# EAGLE design blank_rev_3dip (EAGLE 6.3)
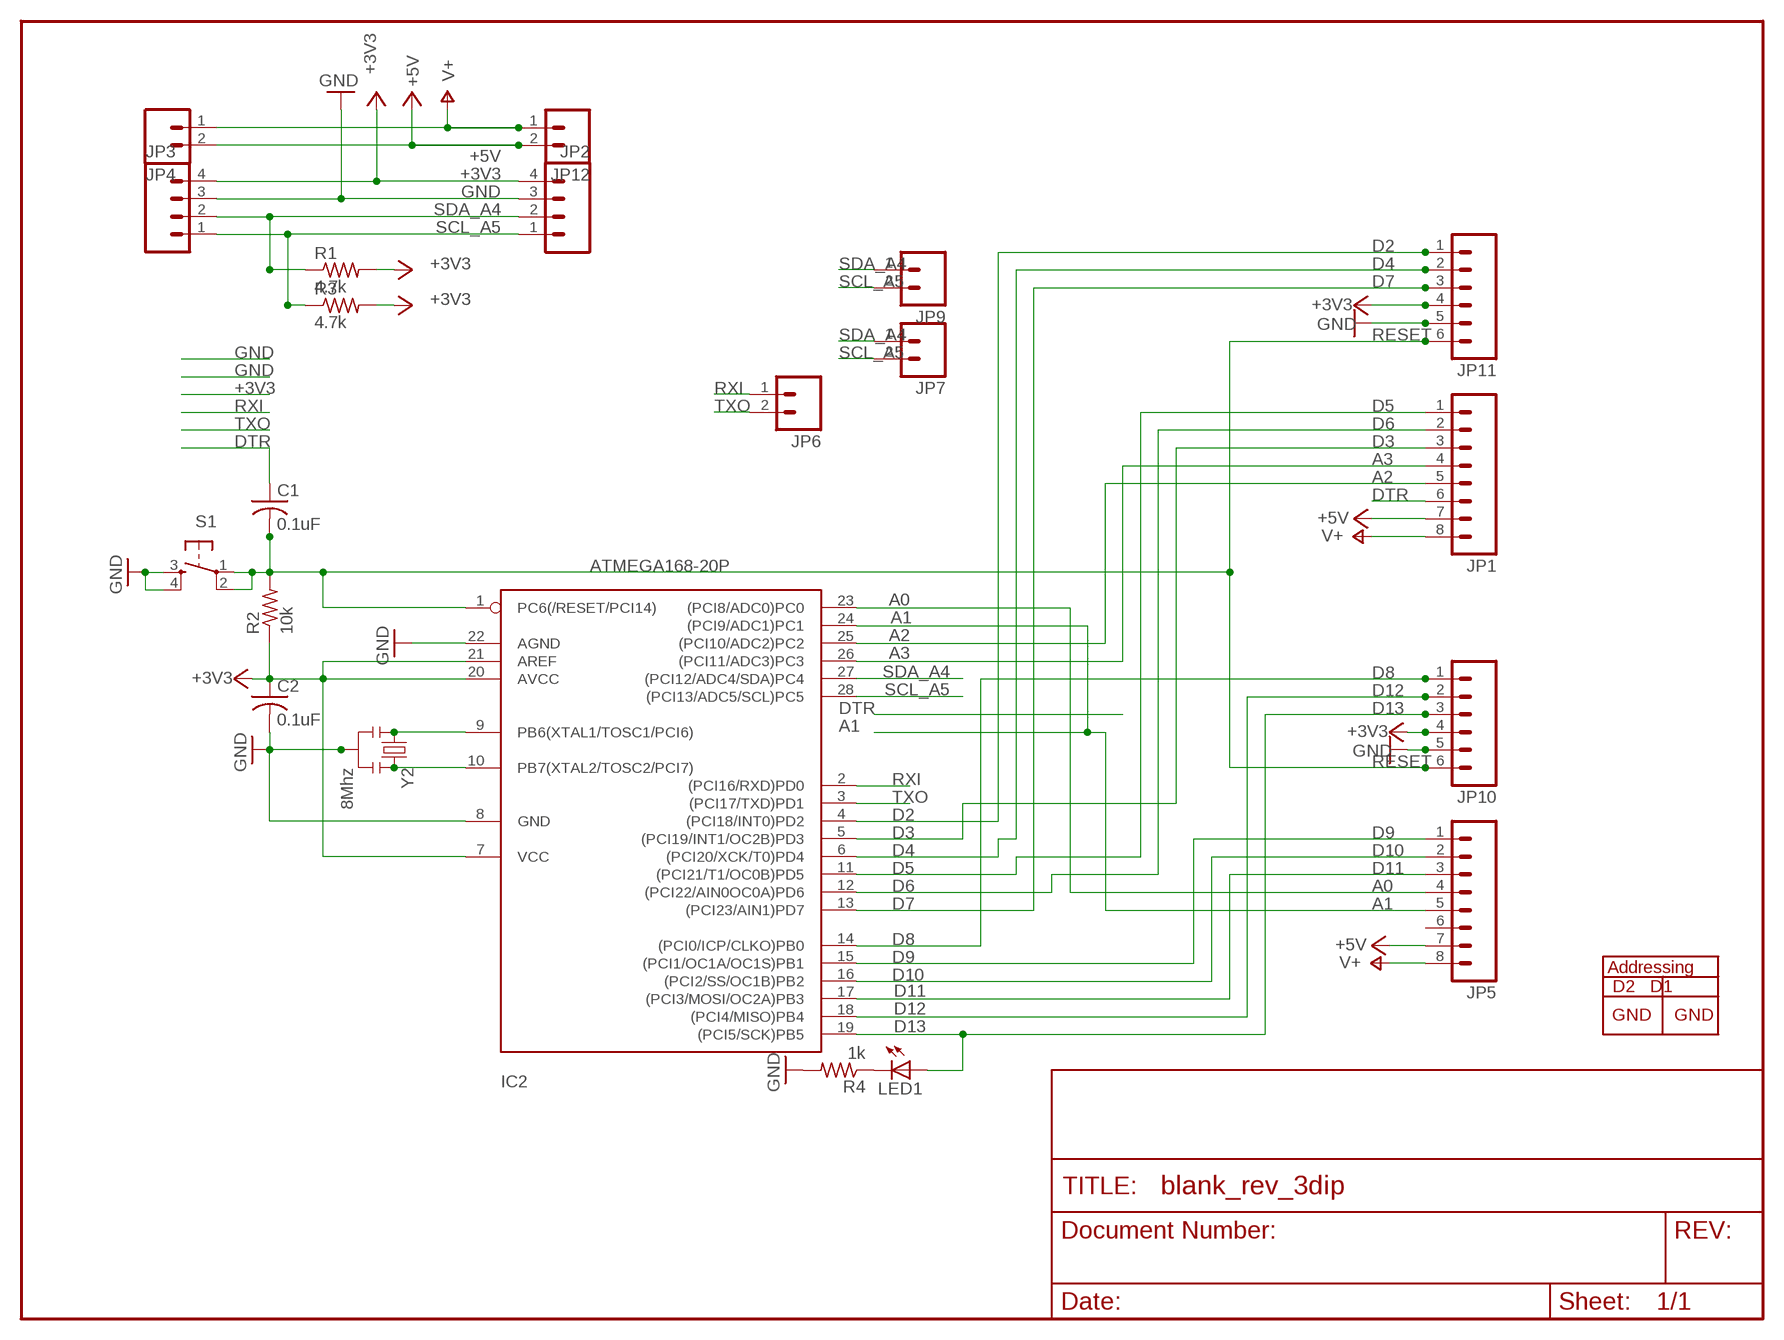
[diagram p0: schematic, sheet 1]

## Parts
C1  0.1uF  C-US025-024X044  [C025-024X044]
C2  0.1uF  C-US025-024X044  [C025-024X044]
IC2  ATMEGA168-20P  [DIL28-3]
JP1  M081X08  [1X08]
JP2  M04PTH  [1X04]
JP3  M04PTH  [1X04]
JP4  M02PTH  [1X02]
JP5  M081X08  [1X08]
JP6  M02PTH  [1X02]
JP7  M02PTH  [1X02]
JP9  M02PTH  [1X02]
JP10  M06SIP  [1X06]
JP11  M06SIP  [1X06]
JP12  M02PTH  [1X02]
LED1  LED3MM  [LED3MM]
R1  4.7k  R-US_0204/7  [0204/7]
R2  10k  R-US_0204/7  [0204/7]
R3  4.7k  R-US_0204/7  [0204/7]
R4  1k  R-US_0204/7  [0204/7]
S1  TAC_SWITCHPTH  [TACTILE-PTH]
Y2  8Mhz  RESONATORPTH  [RESONATOR-PTH]

## Nets
+3V3: C2.1 IC2.7(VCC) IC2.20(AVCC) IC2.21(AREF) JP2.4 JP3.4 JP10.4 JP11.4 R1.2 R2.1 R3.2
+5V: JP1.7 JP4.2 JP5.7 JP12.2
A0: IC2.23((PCI8/ADC0)PC0) JP5.4
A1: IC2.24((PCI9/ADC1)PC1) JP5.5
A2: IC2.25((PCI10/ADC2)PC2) JP1.5
A3: IC2.26((PCI11/ADC3)PC3) JP1.4
D2: IC2.4((PCI18/INT0)PD2) JP11.1
D3: IC2.5((PCI19/INT1/OC2B)PD3) JP1.3
D4: IC2.6((PCI20/XCK/T0)PD4) JP11.2
D5: IC2.11((PCI21/T1/OC0B)PD5) JP1.1
D6: IC2.12((PCI22/AIN0OC0A)PD6) JP1.2
D7: IC2.13((PCI23/AIN1)PD7) JP11.3
D8: IC2.14((PCI0/ICP/CLKO)PB0) JP10.1
D9: IC2.15((PCI1/OC1A/OC1S)PB1) JP5.1
D10: IC2.16((PCI2/SS/OC1B)PB2) JP5.2
D11: IC2.17((PCI3/MOSI/OC2A)PB3) JP5.3
D12: IC2.18((PCI4/MISO)PB4) JP10.2
D13: IC2.19((PCI5/SCK)PB5) JP10.3 LED1.A
DTR: C1.1 JP1.6
GND: C2.2 IC2.8(GND) IC2.22(AGND) JP2.3 JP3.3 JP10.5 JP11.5 R4.2 S1.3 S1.4 Y2.2
N$1: IC2.10(PB7(XTAL2/TOSC2/PCI7)) Y2.3
N$3: IC2.9(PB6(XTAL1/TOSC1/PCI6)) Y2.1
N$4: LED1.K(C) R4.1
RESET: C1.2 IC2.1(PC6(/RESET/PCI14)) JP10.6 JP11.6 R2.2 S1.1 S1.2
RXI: IC2.2((PCI16/RXD)PD0) JP6.1
SCL_A5: IC2.28((PCI13/ADC5/SCL)PC5) JP2.1 JP3.1 JP7.2 JP9.2 R3.1
SDA_A4: IC2.27((PCI12/ADC4/SDA)PC4) JP2.2 JP3.2 JP7.1 JP9.1 R1.1
TXO: IC2.3((PCI17/TXD)PD1) JP6.2
V+: JP1.8 JP4.1 JP5.8 JP12.1
Unconnected: JP5.6

## Library data of the parts
C1 C2 = adafruit:C-US: CAPACITOR, American symbol
IC2 = adafruit:ATMEGA168*P: MICROCONTROLLER 16 kBytes FLASH 1 kBytes SRAM 512 Bytes EEPROM USART 8-channel 10 bit ADC
JP1 JP5 = SparkFun_mod:M08: Header 8 Standard 8-pin 0.1" header. Use with straight break away headers (SKU : PRT-00116), right angle break away headers (PRT-00553), swiss pins (PRT-00743), machine pins (PRT-00117), and female headers (PRT-00115).
JP2 JP3 = SparkFun_mod:M04: Header 4 Standard 4-pin 0.1" header. Use with straight break away headers (SKU : PRT-00116), right angle break away headers (PRT-00553), swiss pins (PRT-00743), machine pins (PRT-00117), and female headers (PRT-00115). Molex polarized connector foot print use with SKU : PRT-08231 with associated crimp pins and housings. 1MM SMD Version SKU: PRT-10208
JP4 JP6 JP7 JP9 JP12 = SparkFun_mod:M02: Header 2 Standard 2-pin 0.1" header. Use with straight break away headers (SKU : PRT-00116), right angle break away headers (PRT-00553), swiss pins (PRT-00743), machine pins (PRT-00117), and female headers (PRT-00115). Molex polarized connector foot print use with SKU : PRT-08233 with associated crimp pins and housings.
JP10 JP11 = SparkFun_mod:M06: Header 6 Standard 6-pin 0.1" header. Use with straight break away headers (SKU : PRT-00116), right angle break away headers (PRT-00553), swiss pins (PRT-00743), machine pins (PRT-00117), and female headers (PRT-00115). Molex polarized connector foot print use with SKU : PRT-08094 with associated crimp pins and housings. NOTES ON THE VARIANTS LOCK and LOCK_LONGPADS... This footprint was designed to help hold the alignment of a through-hole component (i.e. 6-pin header) while soldering it into place. You may notice that each hole has been shifted either up or down by 0.005 of an inch from it's more standard position (which is a perfectly straight line). This slight alteration caused the pins (the squares in the middle) to touch the edges of the holes. Because they are alternating, it causes a "brace" to hold the component in place. 0.005 has proven to be the perfect amount of "off-center" position when using our standard breakaway headers. Although looks a little odd when you look at the bare footprint, once you have a header in there, the alteration is very hard to notice. Also, if you push a header all the way into place, it is covered up entirely on the bottom side. This idea of altering the position of holes to aid alignment will be further integrated into the Sparkfun Library for other footprints. It can help hold any component with 3 or more connection pins.
LED1 = adafruit:LED: LED OSRAM: - CHIPLED LG R971, LG N971, LY N971, LG Q971, LY Q971, LO R971, LY R971 LH N974, LH R974 LS Q976, LO Q976, LY Q976 LO Q996 - Hyper CHIPLED LW Q18S LB Q993, LB Q99A, LB R99A - SideLED LS A670, LO A670, LY A670, LG A670, LP A670 LB A673, LV A673, LT A673, LW A673 LH A674 LY A675 LS A676, LA A676, LO A676, LY A676, LW A676 LS A679, LY A679, LG A679 - Hyper Micro SIDELED® LS Y876, LA Y876, LO Y876, LY Y876 LT Y87S - SmartLED LW L88C, LW L88S LB L89C, LB L89S, LG L890 LS L89K, LO L89K, LY L89K LS L896, LA L896, LO L896, LY L896 - TOPLED LS T670, LO T670, LY T670, LG T670, LP T670 LSG T670, LSP T670, LSY T670, LOP T670, LYG T670 LG T671, LOG T671, LSG T671 LB T673, LV T673, LT T673, LW T673 LH T674 LS T676, LA T676, LO T676, LY T676, LB T676, LH T676, LSB T676, LW T676 LB T67C, LV T67C, LT T67C, LS T67K, LO T67K, LY T67K, LW E67C LS E67B, LA E67B, LO E67B, LY E67B, LB E67C, LV E67C, LT E67C LW T67C LS T679, LY T679, LG T679 LS T770, LO T770, LY T770, LG T770, LP T770 LB T773, LV T773, LT T773, LW T773 LH T774 LS E675, LA E675, LY E675, LS T675 LS T776, LA T776, LO T776, LY T776, LB T776 LHGB T686 LT T68C, LB T68C - Hyper Mini TOPLED® LB M676 - Mini TOPLED Santana® LG M470 LS M47K, LO M47K, LY M47K Source: http://www.osram.convergy.de/
R1-R4 = adafruit:R-US_: RESISTOR, American symbol
S1 = SparkFun:TAC_SWITCH: Momentary Switch Button commonly used for reset or general input. Spark Fun Electronics SKU : COM-00097
Y2 = SparkFun_mod:RESONATOR: Resonator Small SMD resonator. This is the itty bitty 10/20MHz resonators with built in caps. CSTCE10M0G55 and CSTCE20M0V53. Footprint has been reviewed closely but hasn't been tested yet.

## Net classes
0 default: width 0.203 mm
1 vcc: width 0.254 mm

## Board
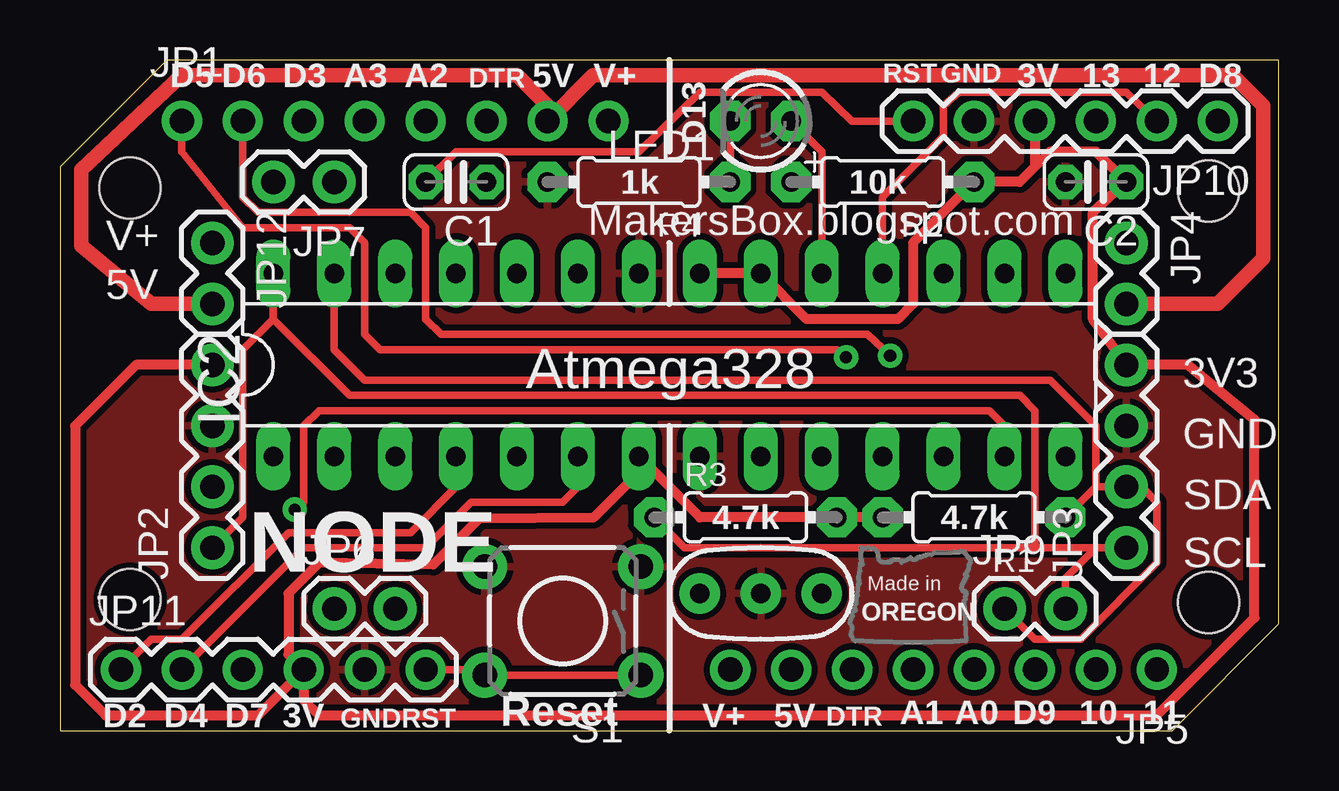
[diagram p1: board, top side]
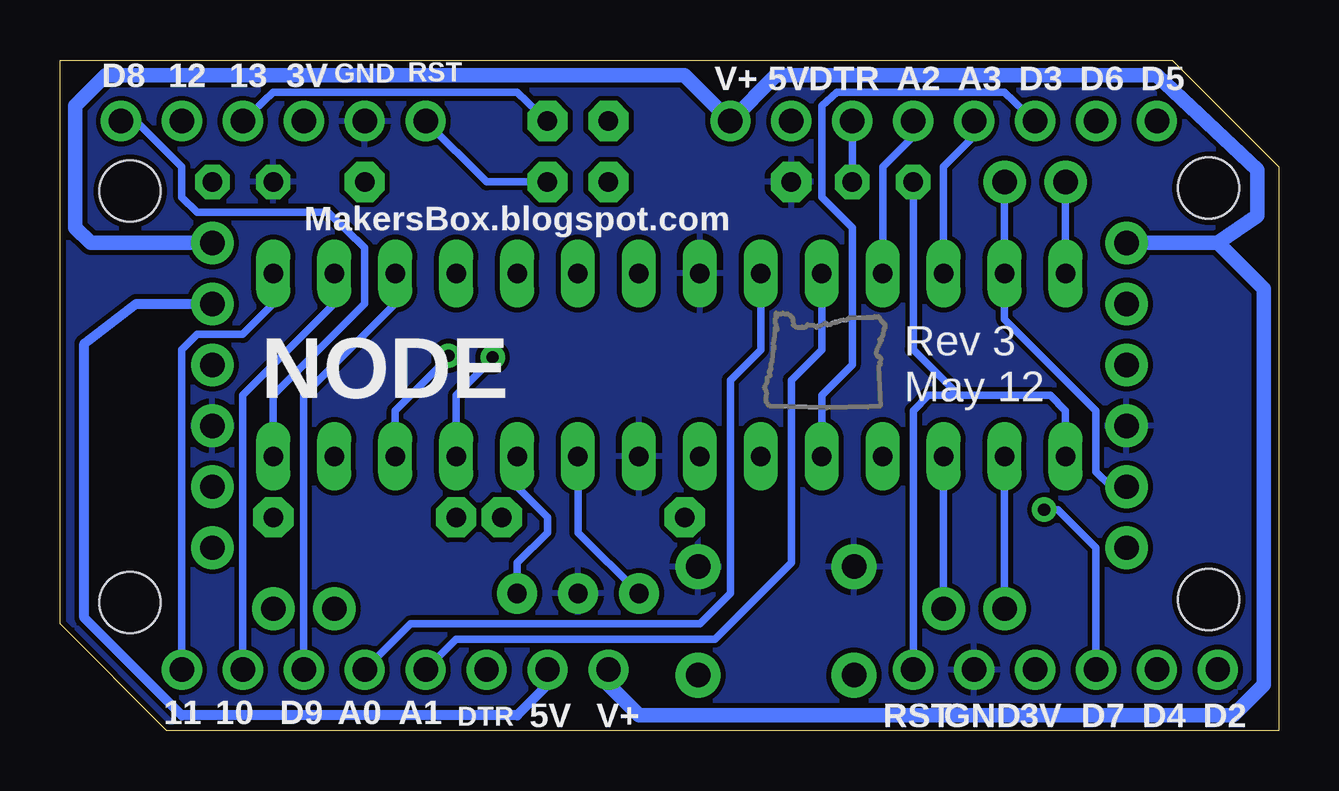
[diagram p2: board, bottom side, seen from below]

Size 50.8 x 27.94 mm. Coordinates in mm from the lower left corner, seen from the top.
Outline: 50.8,4.45 46.36,0 25.4,0 24.77,0 20.96,0 0,0 0,22.86 0,23.5 4.45,27.94 25.4,27.94
Outline: 50.8,4.45 50.8,4.45
Outline: 50.8,4.45 50.8,22.86 50.8,27.94
Outline: 50.8,27.94 27.94,27.94
Outline: 27.94,27.94 27.94,27.94
Outline: 27.94,27.94 25.4,27.94
Copper layers (1*16): Top 0.035mm / dielectric 1.5mm / Bottom 0.035mm
Design rules "SparkFun": minimum track width 8mil, minimum drill 20mil, track to track 8mil, track to pad 8mil, pad to pad 8mil, via to via 8mil, smd to smd 8mil, copper to edge 10mil, drill to drill 8mil, minimum pad ring 12mil, minimum via ring 10mil, stop-mask expansion 4mil, vias tented up to drill 25mil, thermal gap 10mil
Holes 2.54 mm at 47.88,22.48 2.92,5.46 2.92,22.61 47.88,5.33

### Footprints (pad centres in the part's own frame; a part is rotated, then mirrored left to right if it is on the bottom)
C025-024X044 = drill 0.813 pad 1.422 octagon: 1 -1.27,0; 2 1.27,0
DIL28-3 = drill 0.813 long: 1 -16.51,-3.81; 2 -13.97,-3.81; 3 -11.43,-3.81; 4 -8.89,-3.81; 5 -6.35,-3.81; 6 -3.81,-3.81; 7 -1.27,-3.81; 8 1.27,-3.81; 9 3.81,-3.81; 10 6.35,-3.81; 11 8.89,-3.81; 12 11.43,-3.81; 13 13.97,-3.81; 14 16.51,-3.81; 15 16.51,3.81; 16 13.97,3.81; 17 11.43,3.81; 18 8.89,3.81; 19 6.35,3.81; 20 3.81,3.81; 21 1.27,3.81; 22 -1.27,3.81; 23 -3.81,3.81; 24 -6.35,3.81; 25 -8.89,3.81; 26 -11.43,3.81; 27 -13.97,3.81; 28 -16.51,3.81
1X08 = drill 1.016 pad 1.676: 1 0,0; 2 2.54,0; 3 5.08,0; 4 7.62,0; 5 10.16,0; 6 12.7,0; 7 15.24,0; 8 17.78,0
1X04 = drill 1.016 pad 1.778: 1 0,0; 2 2.54,0; 3 5.08,0; 4 7.62,0
1X02 = drill 1.016 pad 1.778: 1 0,0; 2 2.54,0
1X06 = drill 1.016 pad 1.676: 1 0,0; 2 2.54,0; 3 5.08,0; 4 7.62,0; 5 10.16,0; 6 12.7,0
LED3MM = drill 0.813 pad 1.676 octagon: A -1.27,0; K 1.27,0
0204/7 = drill 0.813 pad 1.676 octagon: 1 -3.81,0; 2 3.81,0
TACTILE-PTH = drill 1.016 pad 1.88: 1 -3.251,2.261; 2 3.251,2.261; 3 -3.251,-2.261; 4 3.251,-2.261
RESONATOR-PTH = drill 0.8 pad 1.676: 1 -2.54,0; 2 0,0; 3 2.54,0

### Placement (x,y rotation side)
C1  16.51,22.86 180 top
C2  43.18,22.86 180 top
IC2  25.4,15.24 0 top
JP1  5.08,25.4 0 top
JP2  6.35,7.62 90 top
JP3  44.45,7.62 90 top
JP4  44.45,20.32 270 top
JP5  45.72,2.54 180 top
JP6  11.43,5.08 0 top
JP7  11.43,22.86 180 top
JP9  39.37,5.08 0 top
JP10  48.26,25.4 180 top
JP11  2.54,2.54 0 top
JP12  6.35,20.32 270 top
LED1  29.21,25.4 180 top
R1  38.1,8.89 180 top
R2  34.29,22.86 180 top
R3  28.57,8.89 0 top
R4  24.13,22.86 180 top
S1  20.95,4.57 180 top
U$1  [OREGON_24_52]  20.95,17.4 0 top
U$2  [OREGON_24_51]  33.4,7.62 0 top
Y2  29.21,5.71 0 top

### Tracks (layer width: path | path; a pad name or v marks a point on that pad's centre or on a via)
+3V3
  Top 0.406: JP2.4 3.17,15.24 0.64,12.7 0.64,1.91 1.91,0.64 8.26,0.64 JP11.4 | JP11.4 10.16,1.27 10.79,0.64 45.72,0.64 49.78,4.7 49.78,12.95 46.99,15.24 JP3.4 43.05,17.14 43.05,21.59 C2.1 43.18,24.13 41.27,24.13 40.64,23.5 | JP10.4 40.64,23.5 | 40.64,23.5 40.01,22.86 R2.1 35.56,20.32 35.56,17.78 34.92,17.14 31.11,17.14 IC2.20 IC2.21 | 22.23,8.89 22.23,8.88 | 22.23,8.88 17.46,8.83 15.56,6.92 10.79,6.98 9.53,5.71 9.53,3.17 JP11.4 | R3.2 R1.2 26.67,8.89 IC2.7 24.13,10.78 22.23,8.88
+5V
  Top 0.61: JP4.2 48.26,17.78 50.16,19.68 50.16,26.04 48.9,27.3 22.23,27.3 JP1.7 20.32,26.04 19.05,27.3 5.08,27.3 0.89,23.37 0.89,20.19 3.81,17.78 JP12.2
  Bottom 0.406: JP5.7 30.48,1.91 31.75,0.64 45.72,0.64 49.78,4.7 49.78,16.13 47.62,17.78 JP4.2
A0
  Bottom 0.305: JP5.4 36.2,4.45 24.13,4.45 22.86,5.71 22.86,14.61 21.59,15.88 IC2.23
A1
  Bottom 0.305: IC2.24 19.05,15.88 20.32,14.61 20.32,6.98 23.5,3.81 34.29,3.81 JP5.5
A2
  Bottom 0.305: JP1.5 15.24,24.77 16.51,23.5 IC2.25
A3
  Bottom 0.305: JP1.4 12.7,24.77 13.97,23.5 IC2.26
D2
  Top 0.305: IC2.4 16.51,10.16 14.61,8.26 9.53,8.26 5.08,3.81 3.81,3.81 JP11.1
D3
  Bottom 0.305: JP1.3 11.43,26.61 18.41,26.61 19.05,26.04 19.05,22.22 17.78,20.95 17.78,15.24 19.05,13.97 IC2.5
D4
  Top 0.305: IC2.6 21.59,10.16 20.95,9.53 17.14,9.53 15.24,7.62 10.16,7.62 JP11.2
D5  (via drill 0.51)
  Top 0.305: JP1.1 5.08,24.13 7.62,20.95 12.06,20.95 12.7,20.32 12.7,16.51 13.34,15.88 32.38,15.88 v32.77,15.56
  Bottom 0.305: v32.77,15.56 32.77,15.49 34.29,13.97 IC2.11
D6  (via drill 0.51)
  Top 0.305: v34.61,15.62 33.66,16.51 15.88,16.51 15.24,17.14 15.24,20.95 14.61,21.59 8.26,21.59 7.62,22.22 JP1.2
  Bottom 0.305: IC2.12 36.83,13.33 34.92,15.24 v34.61,15.62
D7  (via drill 0.51)
  Top 0.305: IC2.13 39.37,12.7 38.73,13.33 10.79,13.33 10.16,12.7 10.16,9.53 v9.78,9.21
  Bottom 0.305: v9.78,9.21 9.21,9.21 7.62,7.62 JP11.3
D8
  Bottom 0.305: IC2.14 41.91,13.97 38.1,17.78 38.1,20.13 39.62,21.59 45.09,21.59 45.72,22.22 45.72,23.5 47.62,25.4 JP10.1
D9
  Bottom 0.305: IC2.15 41.91,17.78 43.18,16.51 45.09,16.51 45.72,15.88 JP5.1
D10
  Bottom 0.305: IC2.16 39.37,17.78 43.18,13.97 JP5.2
D11
  Bottom 0.305: IC2.17 36.83,17.78 40.64,13.97 JP5.3
D12
  Top 0.305: JP10.2 44.45,26.61 37.47,26.61 36.83,26.04 36.83,24.77 34.29,22.22 IC2.18
D13
  Top 0.305: IC2.19 31.75,24.13 LED1.A
  Bottom 0.305: JP10.3 41.91,26.61 31.75,26.61 LED1.A
DTR
  Bottom 0.305: C1.1 JP1.6
GND
  pour Top (isolate 0.254): -1.91,29.21 52.07,29.21 52.07,-1.27 -2.54,-0.64
  pour Bottom: -3.17,28.57 52.07,28.57 52.7,-0.64 -2.54,0
N$1
  Bottom 0.305: IC2.10 31.75,10.16 30.48,8.89 30.48,8.26 31.75,6.98 Y2.3
N$3
  Bottom 0.305: Y2.1 29.21,8.26 IC2.9
N$4
  Top 0.305: R4.1 LED1.K
RESET
  Top 0.305: JP11.6 17.6,2.54 S1.2 S1.1 | JP10.6 33.02,25.4 31.75,26.61 26.67,26.61 24.13,24.13 16.51,24.13 C1.2
  Bottom 0.305: C1.2 15.24,15.88 13.34,13.97 | 13.34,13.97 9.53,13.97 8.89,13.33 IC2.1 | 13.34,13.97 14.61,13.97 15.24,13.33 JP11.6 | R2.2 33.02,22.86 JP10.6
RXI
  Bottom 0.305: IC2.2 JP6.1
SCL_A5
  Top 0.305: 8.89,17.14 12.06,13.97 40.01,13.97 40.64,13.33 40.64,7.62 | 8.89,17.14 IC2.28 | JP2.1 7.62,8.89 7.62,15.88 8.89,17.14 | 43.18,7.62 JP3.1 | JP9.2 41.91,6.35 43.18,7.62 | 43.18,7.62 40.64,7.62 | R3.1 26.04,7.62 40.64,7.62
  Bottom 0.305: JP7.2 IC2.28
SDA_A4
  Top 0.305: IC2.27 11.43,15.88 12.7,14.61 41.27,14.61 43.18,12.7 43.18,10.16 | 43.18,10.16 JP3.2 45.09,10.16 45.72,9.53 45.72,6.98 42.55,3.81 40.64,3.81 JP9.1 | 43.18,10.16 R1.1
  Bottom 0.305: JP2.2 6.99,10.16 7.62,10.79 7.62,13.33 11.43,17.14 IC2.27 JP7.1
TXO
  Bottom 0.305: IC2.3 JP6.2
V+
  Bottom 0.61: JP4.1 49.53,20.32 50.16,20.95 50.16,26.04 48.9,27.3 24.77,27.3 JP1.8 20.95,27.3 5.08,27.3 0.89,23.37 0.89,21.46 2.54,20.32 | 2.54,20.32 JP12.1 | JP5.8 27.94,1.91 26.67,0.64 1.91,0.64 0.64,1.91 0.64,18.41 2.54,20.32

### Text on the board
tPlace: RST | GND | 3V | 13 | 12 | D8 | D5 | D6 | D3 | A3 | A2 | DTR | 5V | V+ | D13 | 1k | 10k | MakersBox.blogspot.com | V+ | 5V | Atmega328 | 3V3 | GND | SDA | 4.7k | 4.7k | SCL | NODE | V+ | 5V | DTR | A1 | A0 | D9 | 10 | 11 | D2 | D4 | D7 | 3V | GND | RST | Reset
bPlace: GND | 3V | 13 | 12 | D8 | D5 | D6 | D3 | A3 | A2 | DTR | 5V | V+ | RST | MakersBox.blogspot.com | NODE | Rev 3 / May 12 | DTR | D2 | D4 | D7 | 3V | GND | RST | V+ | 5V | A1 | A0 | D9 | 10 | 11